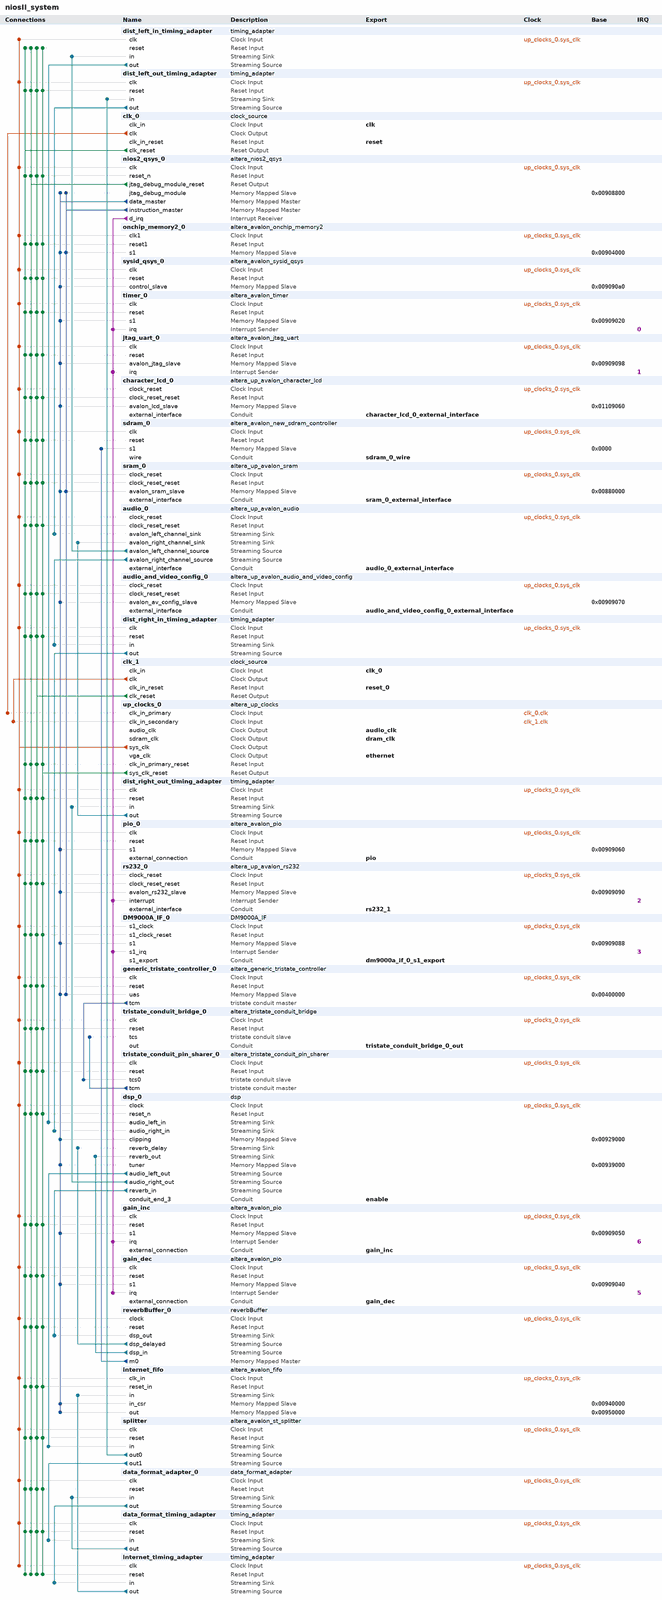
[diagram p0: system contents, whole]
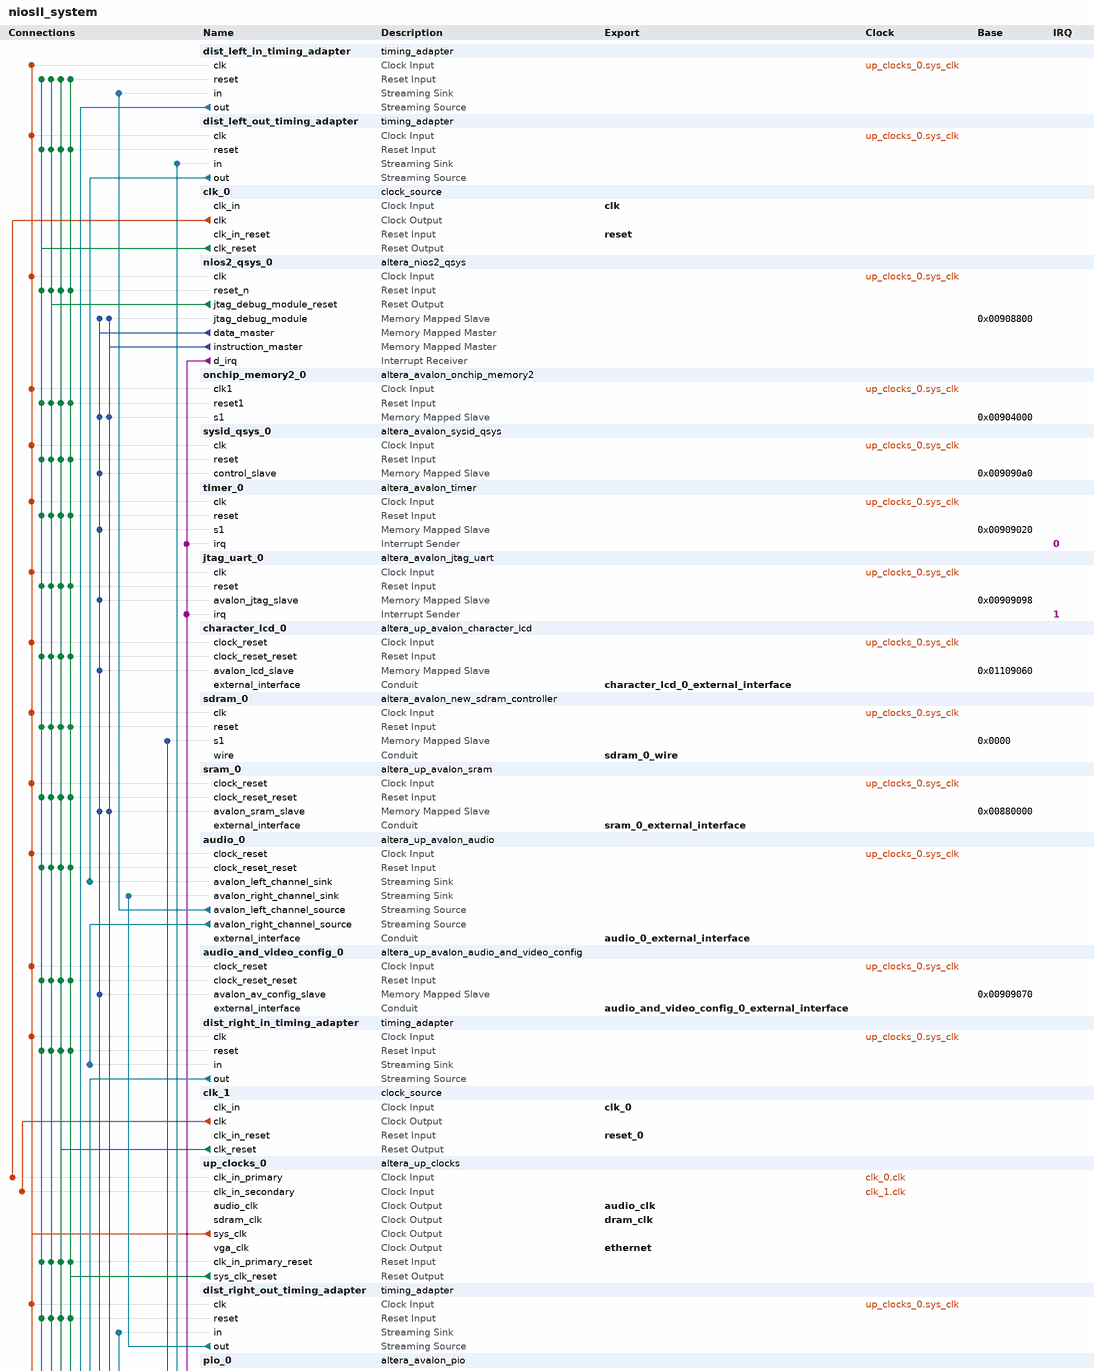
[diagram p1: system contents, upper part]
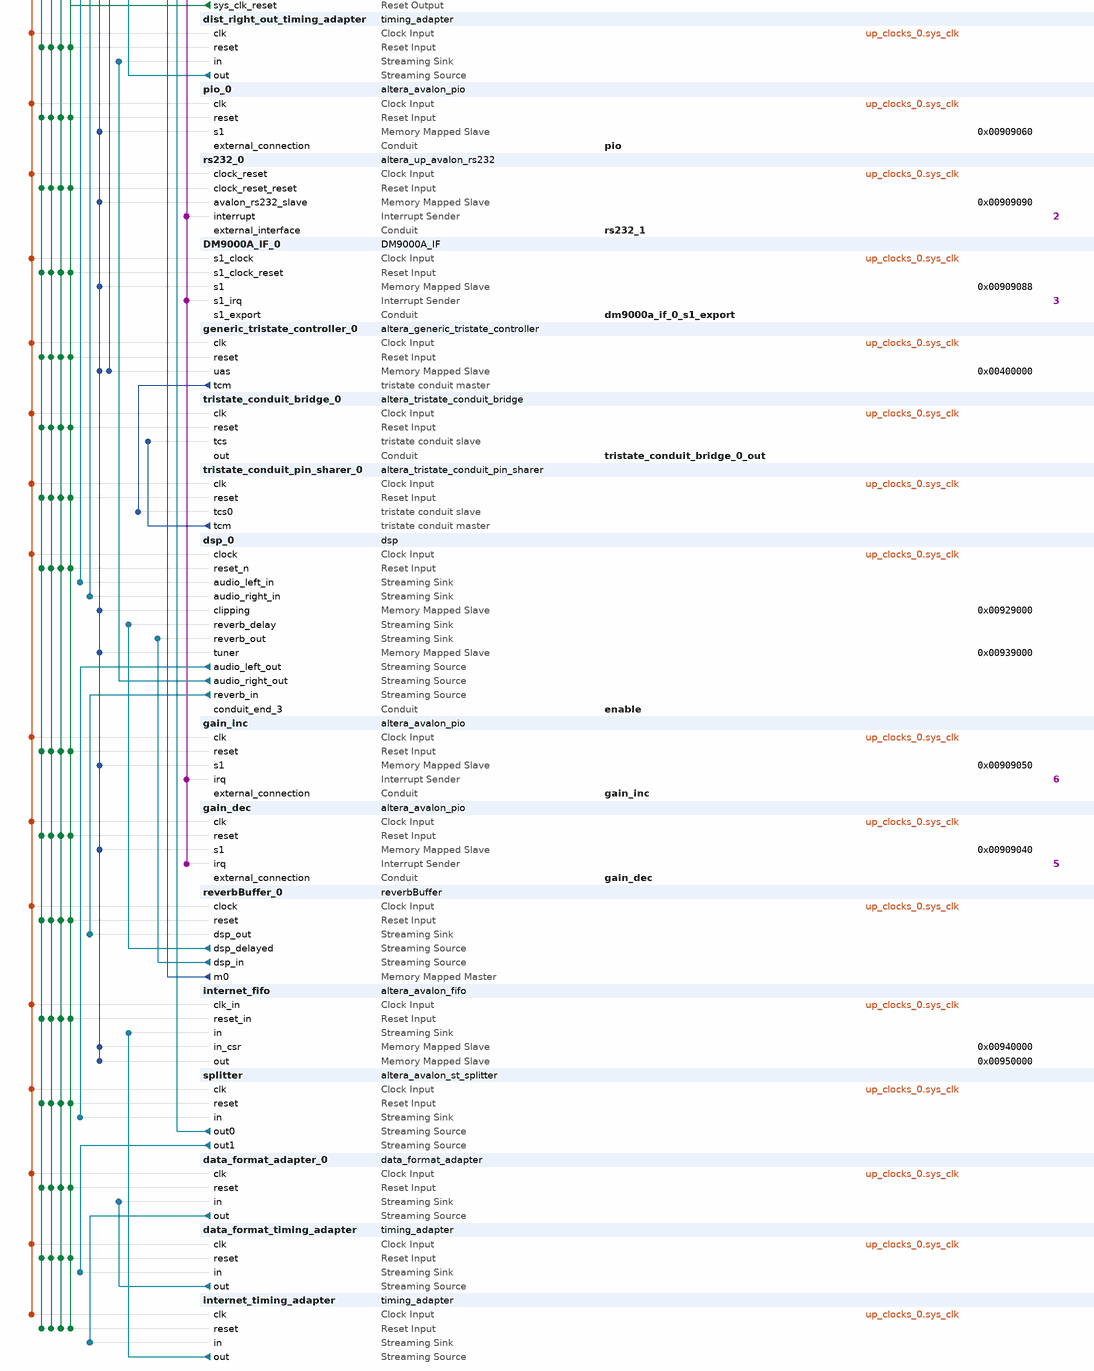
[diagram p2: system contents, lower part]
# Platform Designer (Qsys) system niosII_system, Cyclone II EP2C35F672C6
# Parameters at their usual value, and those the tool derives, are not listed.
package require -exact qsys 12.1
create_system niosII_system
set_project_property DEVICE_FAMILY {Cyclone II}
set_project_property DEVICE EP2C35F672C6

add_instance dist_left_in_timing_adapter timing_adapter 12.1
set_instance_parameter_value dist_left_in_timing_adapter inBitsPerSymbol 8
set_instance_parameter_value dist_left_in_timing_adapter inChannelWidth 0
set_instance_parameter_value dist_left_in_timing_adapter inErrorWidth 0
set_instance_parameter_value dist_left_in_timing_adapter inMaxChannel 0
set_instance_parameter_value dist_left_in_timing_adapter inReadyLatency 0
set_instance_parameter_value dist_left_in_timing_adapter inSymbolsPerBeat 2
set_instance_parameter_value dist_left_in_timing_adapter inUseEmptyPort NO
set_instance_parameter_value dist_left_in_timing_adapter inUsePackets false
set_instance_parameter_value dist_left_in_timing_adapter inUseReady true
set_instance_parameter_value dist_left_in_timing_adapter inUseValid true
set_instance_parameter_value dist_left_in_timing_adapter outReadyLatency 0
set_instance_parameter_value dist_left_in_timing_adapter outUseReady false
set_instance_parameter_value dist_left_in_timing_adapter outUseValid true

add_instance dist_left_out_timing_adapter timing_adapter 12.1
set_instance_parameter_value dist_left_out_timing_adapter inBitsPerSymbol 8
set_instance_parameter_value dist_left_out_timing_adapter inChannelWidth 0
set_instance_parameter_value dist_left_out_timing_adapter inErrorWidth 0
set_instance_parameter_value dist_left_out_timing_adapter inMaxChannel 0
set_instance_parameter_value dist_left_out_timing_adapter inReadyLatency 0
set_instance_parameter_value dist_left_out_timing_adapter inSymbolsPerBeat 2
set_instance_parameter_value dist_left_out_timing_adapter inUseEmptyPort NO
set_instance_parameter_value dist_left_out_timing_adapter inUsePackets false
set_instance_parameter_value dist_left_out_timing_adapter inUseReady false
set_instance_parameter_value dist_left_out_timing_adapter inUseValid true
set_instance_parameter_value dist_left_out_timing_adapter outReadyLatency 0
set_instance_parameter_value dist_left_out_timing_adapter outUseReady true
set_instance_parameter_value dist_left_out_timing_adapter outUseValid true

add_instance clk_0 clock_source 12.1
set_instance_parameter_value clk_0 clockFrequency 50000000

add_instance nios2_qsys_0 altera_nios2_qsys 12.1
set_instance_parameter_value nios2_qsys_0 resetSlave generic_tristate_controller_0.uas
set_instance_parameter_value nios2_qsys_0 exceptionSlave onchip_memory2_0.s1
set_instance_parameter_value nios2_qsys_0 breakSlave nios2_qsys_0.jtag_debug_module
set_instance_parameter_value nios2_qsys_0 impl Small
set_instance_parameter_value nios2_qsys_0 icache_size 4096

add_instance onchip_memory2_0 altera_avalon_onchip_memory2 12.1
set_instance_parameter_value onchip_memory2_0 dataWidth 32
set_instance_parameter_value onchip_memory2_0 dualPort false
set_instance_parameter_value onchip_memory2_0 initMemContent true
set_instance_parameter_value onchip_memory2_0 initializationFileName onchip_memory2_0
set_instance_parameter_value onchip_memory2_0 memorySize 16384

add_instance sysid_qsys_0 altera_avalon_sysid_qsys 12.1
set_instance_parameter_value sysid_qsys_0 id 0

add_instance timer_0 altera_avalon_timer 12.1
set_instance_parameter_value timer_0 period 1
set_instance_parameter_value timer_0 periodUnits MSEC
set_instance_parameter_value timer_0 timerPreset CUSTOM

add_instance jtag_uart_0 altera_avalon_jtag_uart 12.1
set_instance_parameter_value jtag_uart_0 simInteractiveOptions INTERACTIVE_INPUT_OUTPUT

add_instance character_lcd_0 altera_up_avalon_character_lcd 12.0
set_instance_parameter_value character_lcd_0 cursor Normal

add_instance sdram_0 altera_avalon_new_sdram_controller 12.1
set_instance_parameter_value sdram_0 TAC 5.5
set_instance_parameter_value sdram_0 TRCD 20.0
set_instance_parameter_value sdram_0 TRP 20.0
set_instance_parameter_value sdram_0 casLatency 3
set_instance_parameter_value sdram_0 columnWidth 8
set_instance_parameter_value sdram_0 dataWidth 16
set_instance_parameter_value sdram_0 generateSimulationModel false
set_instance_parameter_value sdram_0 model custom
set_instance_parameter_value sdram_0 numberOfBanks 4
set_instance_parameter_value sdram_0 numberOfChipSelects 1
set_instance_parameter_value sdram_0 powerUpDelay 100.0
set_instance_parameter_value sdram_0 refreshPeriod 15.625
set_instance_parameter_value sdram_0 rowWidth 12

add_instance sram_0 altera_up_avalon_sram 12.0
set_instance_parameter_value sram_0 board DE2
set_instance_parameter_value sram_0 pixel_buffer false

add_instance audio_0 altera_up_avalon_audio 12.0
set_instance_parameter_value audio_0 avalon_bus_type Streaming
set_instance_parameter_value audio_0 audio_in true
set_instance_parameter_value audio_0 dw 16

add_instance audio_and_video_config_0 altera_up_avalon_audio_and_video_config 12.0
set_instance_parameter_value audio_and_video_config_0 board DE2
set_instance_parameter_value audio_and_video_config_0 audio_in {Line In to ADC}
set_instance_parameter_value audio_and_video_config_0 line_in_bypass false
set_instance_parameter_value audio_and_video_config_0 bit_length 16
set_instance_parameter_value audio_and_video_config_0 sampling_rate {48 kHz}

add_instance dist_right_in_timing_adapter timing_adapter 12.1
set_instance_parameter_value dist_right_in_timing_adapter inBitsPerSymbol 8
set_instance_parameter_value dist_right_in_timing_adapter inChannelWidth 0
set_instance_parameter_value dist_right_in_timing_adapter inErrorWidth 0
set_instance_parameter_value dist_right_in_timing_adapter inMaxChannel 0
set_instance_parameter_value dist_right_in_timing_adapter inReadyLatency 0
set_instance_parameter_value dist_right_in_timing_adapter inSymbolsPerBeat 2
set_instance_parameter_value dist_right_in_timing_adapter inUseEmptyPort NO
set_instance_parameter_value dist_right_in_timing_adapter inUsePackets false
set_instance_parameter_value dist_right_in_timing_adapter inUseReady true
set_instance_parameter_value dist_right_in_timing_adapter inUseValid true
set_instance_parameter_value dist_right_in_timing_adapter outReadyLatency 0
set_instance_parameter_value dist_right_in_timing_adapter outUseReady false
set_instance_parameter_value dist_right_in_timing_adapter outUseValid true

add_instance clk_1 clock_source 12.1
set_instance_parameter_value clk_1 clockFrequency 27000000

add_instance up_clocks_0 altera_up_clocks 12.0
set_instance_parameter_value up_clocks_0 board DE2
set_instance_parameter_value up_clocks_0 vga_clk true
set_instance_parameter_value up_clocks_0 audio_clk true
set_instance_parameter_value up_clocks_0 audio_clk_freq 11.2896

add_instance dist_right_out_timing_adapter timing_adapter 12.1
set_instance_parameter_value dist_right_out_timing_adapter inBitsPerSymbol 8
set_instance_parameter_value dist_right_out_timing_adapter inChannelWidth 0
set_instance_parameter_value dist_right_out_timing_adapter inErrorWidth 0
set_instance_parameter_value dist_right_out_timing_adapter inMaxChannel 0
set_instance_parameter_value dist_right_out_timing_adapter inReadyLatency 0
set_instance_parameter_value dist_right_out_timing_adapter inSymbolsPerBeat 2
set_instance_parameter_value dist_right_out_timing_adapter inUseEmptyPort NO
set_instance_parameter_value dist_right_out_timing_adapter inUsePackets false
set_instance_parameter_value dist_right_out_timing_adapter inUseReady false
set_instance_parameter_value dist_right_out_timing_adapter inUseValid true
set_instance_parameter_value dist_right_out_timing_adapter outReadyLatency 0
set_instance_parameter_value dist_right_out_timing_adapter outUseReady true
set_instance_parameter_value dist_right_out_timing_adapter outUseValid true

add_instance pio_0 altera_avalon_pio 12.1
set_instance_parameter_value pio_0 direction Input
set_instance_parameter_value pio_0 width 5

add_instance rs232_0 altera_up_avalon_rs232 12.0
set_instance_parameter_value rs232_0 baud 9600
set_instance_parameter_value rs232_0 parity None

add_instance DM9000A_IF_0 DM9000A_IF 1.0

add_instance generic_tristate_controller_0 altera_generic_tristate_controller 12.1
set_instance_parameter_value generic_tristate_controller_0 TCM_ADDRESS_W 22
set_instance_parameter_value generic_tristate_controller_0 TCM_DATA_W 8
set_instance_parameter_value generic_tristate_controller_0 TCM_BYTEENABLE_W 1
set_instance_parameter_value generic_tristate_controller_0 TCM_READ_WAIT 160
set_instance_parameter_value generic_tristate_controller_0 TCM_WRITE_WAIT 160
set_instance_parameter_value generic_tristate_controller_0 TCM_SETUP_WAIT 40
set_instance_parameter_value generic_tristate_controller_0 TCM_DATA_HOLD 40
set_instance_parameter_value generic_tristate_controller_0 TCM_MAX_PENDING_READ_TRANSACTIONS 3
set_instance_parameter_value generic_tristate_controller_0 TCM_TURNAROUND_TIME 2
set_instance_parameter_value generic_tristate_controller_0 TCM_TIMING_UNITS 0
set_instance_parameter_value generic_tristate_controller_0 TCM_READLATENCY 2
set_instance_parameter_value generic_tristate_controller_0 TCM_SYMBOLS_PER_WORD 1
set_instance_parameter_value generic_tristate_controller_0 USE_READ 1
set_instance_parameter_value generic_tristate_controller_0 USE_BEGINTRANSFER 0
set_instance_parameter_value generic_tristate_controller_0 USE_BYTEENABLE 0
set_instance_parameter_value generic_tristate_controller_0 USE_OUTPUTENABLE 0
set_instance_parameter_value generic_tristate_controller_0 ACTIVE_LOW_READ 1
set_instance_parameter_value generic_tristate_controller_0 ACTIVE_LOW_BYTEENABLE 0
set_instance_parameter_value generic_tristate_controller_0 ACTIVE_LOW_OUTPUTENABLE 0
set_instance_parameter_value generic_tristate_controller_0 ACTIVE_LOW_BEGINTRANSFER 0
set_instance_parameter_value generic_tristate_controller_0 CHIPSELECT_THROUGH_READLATENCY 0
set_instance_parameter_value generic_tristate_controller_0 MODULE_ASSIGNMENT_KEYS embeddedsw.configuration.hwClassnameDriverSupportList,embeddedsw.configuration.isFlash,embeddedsw.configuration.isMemoryDevice,embeddedsw.configuration.isNonVolatileStorage
set_instance_parameter_value generic_tristate_controller_0 MODULE_ASSIGNMENT_VALUES "altera_avalon_lan91c111\\,altera_avalon_cfi_flash,1,1,1"
set_instance_parameter_value generic_tristate_controller_0 INTERFACE_ASSIGNMENT_KEYS embeddedsw.configuration.isFlash,embeddedsw.configuration.isMemoryDevice,embeddedsw.configuration.isNonVolatileStorage
set_instance_parameter_value generic_tristate_controller_0 INTERFACE_ASSIGNMENT_VALUES 1,1,1

add_instance tristate_conduit_bridge_0 altera_tristate_conduit_bridge 12.1

add_instance tristate_conduit_pin_sharer_0 altera_tristate_conduit_pin_sharer 12.1
set_instance_parameter_value tristate_conduit_pin_sharer_0 NUM_INTERFACES 1
set_instance_parameter_value tristate_conduit_pin_sharer_0 MODULE_ORIGIN_LIST generic_tristate_controller_0.tcm,generic_tristate_controller_0.tcm,generic_tristate_controller_0.tcm,generic_tristate_controller_0.tcm,generic_tristate_controller_0.tcm

add_instance dsp_0 dsp 1.0

add_instance gain_inc altera_avalon_pio 12.1
set_instance_parameter_value gain_inc captureEdge true
set_instance_parameter_value gain_inc direction Input
set_instance_parameter_value gain_inc edgeType FALLING
set_instance_parameter_value gain_inc generateIRQ true
set_instance_parameter_value gain_inc irqType EDGE
set_instance_parameter_value gain_inc width 1

add_instance gain_dec altera_avalon_pio 12.1
set_instance_parameter_value gain_dec captureEdge true
set_instance_parameter_value gain_dec direction Input
set_instance_parameter_value gain_dec edgeType FALLING
set_instance_parameter_value gain_dec generateIRQ true
set_instance_parameter_value gain_dec irqType EDGE
set_instance_parameter_value gain_dec width 1

add_instance reverbBuffer_0 reverbBuffer 1.0
set_instance_parameter_value reverbBuffer_0 base_addr 0
set_instance_parameter_value reverbBuffer_0 buffersize 1321

add_instance internet_fifo altera_avalon_fifo 12.1
set_instance_parameter_value internet_fifo bitsPerSymbol 8
set_instance_parameter_value internet_fifo channelWidth 0
set_instance_parameter_value internet_fifo errorWidth 0
set_instance_parameter_value internet_fifo fifoDepth 4096
set_instance_parameter_value internet_fifo fifoInputInterfaceOptions AVALONST_SINK
set_instance_parameter_value internet_fifo fifoOutputInterfaceOptions AVALONMM_READ
set_instance_parameter_value internet_fifo singleClockMode true
set_instance_parameter_value internet_fifo symbolsPerBeat 4
set_instance_parameter_value internet_fifo useIRQ false
set_instance_parameter_value internet_fifo usePacket false
set_instance_parameter_value internet_fifo useReadControl false

add_instance splitter altera_avalon_st_splitter 12.1
set_instance_parameter_value splitter NUMBER_OF_OUTPUTS 2
set_instance_parameter_value splitter QUALIFY_VALID_OUT 1
set_instance_parameter_value splitter USE_READY 0
set_instance_parameter_value splitter USE_VALID 1
set_instance_parameter_value splitter USE_PACKETS 0
set_instance_parameter_value splitter USE_CHANNEL 0
set_instance_parameter_value splitter USE_ERROR 0
set_instance_parameter_value splitter USE_DATA 1
set_instance_parameter_value splitter DATA_WIDTH 16
set_instance_parameter_value splitter CHANNEL_WIDTH 1
set_instance_parameter_value splitter ERROR_WIDTH 1
set_instance_parameter_value splitter BITS_PER_SYMBOL 8
set_instance_parameter_value splitter MAX_CHANNELS 1
set_instance_parameter_value splitter READY_LATENCY 0

add_instance data_format_adapter_0 data_format_adapter 12.1
set_instance_parameter_value data_format_adapter_0 generationLanguage VERILOG
set_instance_parameter_value data_format_adapter_0 inBitsPerSymbol 8
set_instance_parameter_value data_format_adapter_0 inChannelWidth 0
set_instance_parameter_value data_format_adapter_0 inErrorWidth 0
set_instance_parameter_value data_format_adapter_0 inMaxChannel 0
set_instance_parameter_value data_format_adapter_0 inReadyLatency 0
set_instance_parameter_value data_format_adapter_0 inSymbolsPerBeat 2
set_instance_parameter_value data_format_adapter_0 inUseEmpty false
set_instance_parameter_value data_format_adapter_0 inUseEmptyPort AUTO
set_instance_parameter_value data_format_adapter_0 inUsePackets false
set_instance_parameter_value data_format_adapter_0 inUseReady true
set_instance_parameter_value data_format_adapter_0 outSymbolsPerBeat 4
set_instance_parameter_value data_format_adapter_0 outUseEmpty false
set_instance_parameter_value data_format_adapter_0 outUseEmptyPort AUTO

add_instance data_format_timing_adapter timing_adapter 12.1
set_instance_parameter_value data_format_timing_adapter inBitsPerSymbol 8
set_instance_parameter_value data_format_timing_adapter inChannelWidth 0
set_instance_parameter_value data_format_timing_adapter inErrorWidth 0
set_instance_parameter_value data_format_timing_adapter inMaxChannel 0
set_instance_parameter_value data_format_timing_adapter inReadyLatency 0
set_instance_parameter_value data_format_timing_adapter inSymbolsPerBeat 2
set_instance_parameter_value data_format_timing_adapter inUseEmptyPort NO
set_instance_parameter_value data_format_timing_adapter inUsePackets false
set_instance_parameter_value data_format_timing_adapter inUseReady false
set_instance_parameter_value data_format_timing_adapter inUseValid true
set_instance_parameter_value data_format_timing_adapter outReadyLatency 0
set_instance_parameter_value data_format_timing_adapter outUseReady true
set_instance_parameter_value data_format_timing_adapter outUseValid true

add_instance internet_timing_adapter timing_adapter 12.1
set_instance_parameter_value internet_timing_adapter inBitsPerSymbol 8
set_instance_parameter_value internet_timing_adapter inChannelWidth 0
set_instance_parameter_value internet_timing_adapter inErrorWidth 0
set_instance_parameter_value internet_timing_adapter inMaxChannel 0
set_instance_parameter_value internet_timing_adapter inReadyLatency 0
set_instance_parameter_value internet_timing_adapter inSymbolsPerBeat 4
set_instance_parameter_value internet_timing_adapter inUseEmptyPort NO
set_instance_parameter_value internet_timing_adapter inUsePackets false
set_instance_parameter_value internet_timing_adapter inUseReady true
set_instance_parameter_value internet_timing_adapter inUseValid true
set_instance_parameter_value internet_timing_adapter outReadyLatency 1
set_instance_parameter_value internet_timing_adapter outUseReady true
set_instance_parameter_value internet_timing_adapter outUseValid true

# connections
add_connection clk_0.clk up_clocks_0.clk_in_primary clock
add_connection clk_1.clk up_clocks_0.clk_in_secondary clock
add_connection up_clocks_0.sys_clk audio_0.clock_reset clock
add_connection up_clocks_0.sys_clk audio_and_video_config_0.clock_reset clock
add_connection up_clocks_0.sys_clk character_lcd_0.clock_reset clock
add_connection up_clocks_0.sys_clk data_format_adapter_0.clk clock
add_connection up_clocks_0.sys_clk data_format_timing_adapter.clk clock
add_connection up_clocks_0.sys_clk dist_left_in_timing_adapter.clk clock
add_connection up_clocks_0.sys_clk dist_left_out_timing_adapter.clk clock
add_connection up_clocks_0.sys_clk dist_right_in_timing_adapter.clk clock
add_connection up_clocks_0.sys_clk dist_right_out_timing_adapter.clk clock
add_connection up_clocks_0.sys_clk DM9000A_IF_0.s1_clock clock
add_connection up_clocks_0.sys_clk dsp_0.clock clock
add_connection up_clocks_0.sys_clk gain_dec.clk clock
add_connection up_clocks_0.sys_clk gain_inc.clk clock
add_connection up_clocks_0.sys_clk generic_tristate_controller_0.clk clock
add_connection up_clocks_0.sys_clk internet_fifo.clk_in clock
add_connection up_clocks_0.sys_clk internet_timing_adapter.clk clock
add_connection up_clocks_0.sys_clk jtag_uart_0.clk clock
add_connection up_clocks_0.sys_clk nios2_qsys_0.clk clock
add_connection up_clocks_0.sys_clk onchip_memory2_0.clk1 clock
add_connection up_clocks_0.sys_clk pio_0.clk clock
add_connection up_clocks_0.sys_clk reverbBuffer_0.clock clock
add_connection up_clocks_0.sys_clk rs232_0.clock_reset clock
add_connection up_clocks_0.sys_clk sdram_0.clk clock
add_connection up_clocks_0.sys_clk splitter.clk clock
add_connection up_clocks_0.sys_clk sram_0.clock_reset clock
add_connection up_clocks_0.sys_clk sysid_qsys_0.clk clock
add_connection up_clocks_0.sys_clk timer_0.clk clock
add_connection up_clocks_0.sys_clk tristate_conduit_bridge_0.clk clock
add_connection up_clocks_0.sys_clk tristate_conduit_pin_sharer_0.clk clock
add_connection clk_0.clk_reset audio_0.clock_reset_reset reset
add_connection clk_0.clk_reset audio_and_video_config_0.clock_reset_reset reset
add_connection clk_0.clk_reset character_lcd_0.clock_reset_reset reset
add_connection clk_0.clk_reset data_format_adapter_0.reset reset
add_connection clk_0.clk_reset data_format_timing_adapter.reset reset
add_connection clk_0.clk_reset dist_left_in_timing_adapter.reset reset
add_connection clk_0.clk_reset dist_left_out_timing_adapter.reset reset
add_connection clk_0.clk_reset dist_right_in_timing_adapter.reset reset
add_connection clk_0.clk_reset dist_right_out_timing_adapter.reset reset
add_connection clk_0.clk_reset DM9000A_IF_0.s1_clock_reset reset
add_connection clk_0.clk_reset dsp_0.reset_n reset
add_connection clk_0.clk_reset gain_dec.reset reset
add_connection clk_0.clk_reset gain_inc.reset reset
add_connection clk_0.clk_reset generic_tristate_controller_0.reset reset
add_connection clk_0.clk_reset internet_fifo.reset_in reset
add_connection clk_0.clk_reset internet_timing_adapter.reset reset
add_connection clk_0.clk_reset jtag_uart_0.reset reset
add_connection clk_0.clk_reset nios2_qsys_0.reset_n reset
add_connection clk_0.clk_reset onchip_memory2_0.reset1 reset
add_connection clk_0.clk_reset pio_0.reset reset
add_connection clk_0.clk_reset reverbBuffer_0.reset reset
add_connection clk_0.clk_reset rs232_0.clock_reset_reset reset
add_connection clk_0.clk_reset sdram_0.reset reset
add_connection clk_0.clk_reset splitter.reset reset
add_connection clk_0.clk_reset sram_0.clock_reset_reset reset
add_connection clk_0.clk_reset sysid_qsys_0.reset reset
add_connection clk_0.clk_reset timer_0.reset reset
add_connection clk_0.clk_reset tristate_conduit_bridge_0.reset reset
add_connection clk_0.clk_reset tristate_conduit_pin_sharer_0.reset reset
add_connection clk_0.clk_reset up_clocks_0.clk_in_primary_reset reset
add_connection clk_1.clk_reset audio_0.clock_reset_reset reset
add_connection clk_1.clk_reset audio_and_video_config_0.clock_reset_reset reset
add_connection clk_1.clk_reset character_lcd_0.clock_reset_reset reset
add_connection clk_1.clk_reset data_format_adapter_0.reset reset
add_connection clk_1.clk_reset data_format_timing_adapter.reset reset
add_connection clk_1.clk_reset dist_left_in_timing_adapter.reset reset
add_connection clk_1.clk_reset dist_left_out_timing_adapter.reset reset
add_connection clk_1.clk_reset dist_right_in_timing_adapter.reset reset
add_connection clk_1.clk_reset dist_right_out_timing_adapter.reset reset
add_connection clk_1.clk_reset DM9000A_IF_0.s1_clock_reset reset
add_connection clk_1.clk_reset dsp_0.reset_n reset
add_connection clk_1.clk_reset gain_dec.reset reset
add_connection clk_1.clk_reset gain_inc.reset reset
add_connection clk_1.clk_reset generic_tristate_controller_0.reset reset
add_connection clk_1.clk_reset internet_fifo.reset_in reset
add_connection clk_1.clk_reset internet_timing_adapter.reset reset
add_connection clk_1.clk_reset jtag_uart_0.reset reset
add_connection clk_1.clk_reset nios2_qsys_0.reset_n reset
add_connection clk_1.clk_reset onchip_memory2_0.reset1 reset
add_connection clk_1.clk_reset pio_0.reset reset
add_connection clk_1.clk_reset reverbBuffer_0.reset reset
add_connection clk_1.clk_reset rs232_0.clock_reset_reset reset
add_connection clk_1.clk_reset sdram_0.reset reset
add_connection clk_1.clk_reset splitter.reset reset
add_connection clk_1.clk_reset sram_0.clock_reset_reset reset
add_connection clk_1.clk_reset sysid_qsys_0.reset reset
add_connection clk_1.clk_reset timer_0.reset reset
add_connection clk_1.clk_reset tristate_conduit_bridge_0.reset reset
add_connection clk_1.clk_reset tristate_conduit_pin_sharer_0.reset reset
add_connection clk_1.clk_reset up_clocks_0.clk_in_primary_reset reset
add_connection nios2_qsys_0.jtag_debug_module_reset audio_0.clock_reset_reset reset
add_connection nios2_qsys_0.jtag_debug_module_reset audio_and_video_config_0.clock_reset_reset reset
add_connection nios2_qsys_0.jtag_debug_module_reset character_lcd_0.clock_reset_reset reset
add_connection nios2_qsys_0.jtag_debug_module_reset data_format_adapter_0.reset reset
add_connection nios2_qsys_0.jtag_debug_module_reset data_format_timing_adapter.reset reset
add_connection nios2_qsys_0.jtag_debug_module_reset dist_left_in_timing_adapter.reset reset
add_connection nios2_qsys_0.jtag_debug_module_reset dist_left_out_timing_adapter.reset reset
add_connection nios2_qsys_0.jtag_debug_module_reset dist_right_in_timing_adapter.reset reset
add_connection nios2_qsys_0.jtag_debug_module_reset dist_right_out_timing_adapter.reset reset
add_connection nios2_qsys_0.jtag_debug_module_reset DM9000A_IF_0.s1_clock_reset reset
add_connection nios2_qsys_0.jtag_debug_module_reset dsp_0.reset_n reset
add_connection nios2_qsys_0.jtag_debug_module_reset gain_dec.reset reset
add_connection nios2_qsys_0.jtag_debug_module_reset gain_inc.reset reset
add_connection nios2_qsys_0.jtag_debug_module_reset generic_tristate_controller_0.reset reset
add_connection nios2_qsys_0.jtag_debug_module_reset internet_fifo.reset_in reset
add_connection nios2_qsys_0.jtag_debug_module_reset internet_timing_adapter.reset reset
add_connection nios2_qsys_0.jtag_debug_module_reset jtag_uart_0.reset reset
add_connection nios2_qsys_0.jtag_debug_module_reset nios2_qsys_0.reset_n reset
add_connection nios2_qsys_0.jtag_debug_module_reset onchip_memory2_0.reset1 reset
add_connection nios2_qsys_0.jtag_debug_module_reset pio_0.reset reset
add_connection nios2_qsys_0.jtag_debug_module_reset reverbBuffer_0.reset reset
add_connection nios2_qsys_0.jtag_debug_module_reset rs232_0.clock_reset_reset reset
add_connection nios2_qsys_0.jtag_debug_module_reset sdram_0.reset reset
add_connection nios2_qsys_0.jtag_debug_module_reset splitter.reset reset
add_connection nios2_qsys_0.jtag_debug_module_reset sram_0.clock_reset_reset reset
add_connection nios2_qsys_0.jtag_debug_module_reset sysid_qsys_0.reset reset
add_connection nios2_qsys_0.jtag_debug_module_reset timer_0.reset reset
add_connection nios2_qsys_0.jtag_debug_module_reset tristate_conduit_bridge_0.reset reset
add_connection nios2_qsys_0.jtag_debug_module_reset tristate_conduit_pin_sharer_0.reset reset
add_connection nios2_qsys_0.jtag_debug_module_reset up_clocks_0.clk_in_primary_reset reset
add_connection up_clocks_0.sys_clk_reset audio_0.clock_reset_reset reset
add_connection up_clocks_0.sys_clk_reset audio_and_video_config_0.clock_reset_reset reset
add_connection up_clocks_0.sys_clk_reset character_lcd_0.clock_reset_reset reset
add_connection up_clocks_0.sys_clk_reset data_format_adapter_0.reset reset
add_connection up_clocks_0.sys_clk_reset data_format_timing_adapter.reset reset
add_connection up_clocks_0.sys_clk_reset dist_left_in_timing_adapter.reset reset
add_connection up_clocks_0.sys_clk_reset dist_left_out_timing_adapter.reset reset
add_connection up_clocks_0.sys_clk_reset dist_right_in_timing_adapter.reset reset
add_connection up_clocks_0.sys_clk_reset dist_right_out_timing_adapter.reset reset
add_connection up_clocks_0.sys_clk_reset DM9000A_IF_0.s1_clock_reset reset
add_connection up_clocks_0.sys_clk_reset dsp_0.reset_n reset
add_connection up_clocks_0.sys_clk_reset gain_dec.reset reset
add_connection up_clocks_0.sys_clk_reset gain_inc.reset reset
add_connection up_clocks_0.sys_clk_reset generic_tristate_controller_0.reset reset
add_connection up_clocks_0.sys_clk_reset internet_fifo.reset_in reset
add_connection up_clocks_0.sys_clk_reset internet_timing_adapter.reset reset
add_connection up_clocks_0.sys_clk_reset jtag_uart_0.reset reset
add_connection up_clocks_0.sys_clk_reset nios2_qsys_0.reset_n reset
add_connection up_clocks_0.sys_clk_reset onchip_memory2_0.reset1 reset
add_connection up_clocks_0.sys_clk_reset pio_0.reset reset
add_connection up_clocks_0.sys_clk_reset reverbBuffer_0.reset reset
add_connection up_clocks_0.sys_clk_reset rs232_0.clock_reset_reset reset
add_connection up_clocks_0.sys_clk_reset sdram_0.reset reset
add_connection up_clocks_0.sys_clk_reset splitter.reset reset
add_connection up_clocks_0.sys_clk_reset sram_0.clock_reset_reset reset
add_connection up_clocks_0.sys_clk_reset sysid_qsys_0.reset reset
add_connection up_clocks_0.sys_clk_reset timer_0.reset reset
add_connection up_clocks_0.sys_clk_reset tristate_conduit_bridge_0.reset reset
add_connection up_clocks_0.sys_clk_reset tristate_conduit_pin_sharer_0.reset reset
add_connection up_clocks_0.sys_clk_reset up_clocks_0.clk_in_primary_reset reset
add_connection nios2_qsys_0.data_master audio_and_video_config_0.avalon_av_config_slave avalon
set_connection_parameter_value nios2_qsys_0.data_master/audio_and_video_config_0.avalon_av_config_slave baseAddress 0x00909070
add_connection nios2_qsys_0.data_master character_lcd_0.avalon_lcd_slave avalon
set_connection_parameter_value nios2_qsys_0.data_master/character_lcd_0.avalon_lcd_slave baseAddress 0x01109060
add_connection nios2_qsys_0.data_master DM9000A_IF_0.s1 avalon
set_connection_parameter_value nios2_qsys_0.data_master/DM9000A_IF_0.s1 baseAddress 0x00909088
add_connection nios2_qsys_0.data_master dsp_0.clipping avalon
set_connection_parameter_value nios2_qsys_0.data_master/dsp_0.clipping baseAddress 0x00929000
add_connection nios2_qsys_0.data_master dsp_0.tuner avalon
set_connection_parameter_value nios2_qsys_0.data_master/dsp_0.tuner baseAddress 0x00939000
add_connection nios2_qsys_0.data_master gain_dec.s1 avalon
set_connection_parameter_value nios2_qsys_0.data_master/gain_dec.s1 baseAddress 0x00909040
add_connection nios2_qsys_0.data_master gain_inc.s1 avalon
set_connection_parameter_value nios2_qsys_0.data_master/gain_inc.s1 baseAddress 0x00909050
add_connection nios2_qsys_0.data_master generic_tristate_controller_0.uas avalon
set_connection_parameter_value nios2_qsys_0.data_master/generic_tristate_controller_0.uas baseAddress 0x00400000
add_connection nios2_qsys_0.data_master internet_fifo.in_csr avalon
set_connection_parameter_value nios2_qsys_0.data_master/internet_fifo.in_csr baseAddress 0x00940000
add_connection nios2_qsys_0.data_master internet_fifo.out avalon
set_connection_parameter_value nios2_qsys_0.data_master/internet_fifo.out baseAddress 0x00950000
add_connection nios2_qsys_0.data_master jtag_uart_0.avalon_jtag_slave avalon
set_connection_parameter_value nios2_qsys_0.data_master/jtag_uart_0.avalon_jtag_slave baseAddress 0x00909098
add_connection nios2_qsys_0.data_master nios2_qsys_0.jtag_debug_module avalon
set_connection_parameter_value nios2_qsys_0.data_master/nios2_qsys_0.jtag_debug_module baseAddress 0x00908800
add_connection nios2_qsys_0.data_master onchip_memory2_0.s1 avalon
set_connection_parameter_value nios2_qsys_0.data_master/onchip_memory2_0.s1 baseAddress 0x00904000
add_connection nios2_qsys_0.data_master pio_0.s1 avalon
set_connection_parameter_value nios2_qsys_0.data_master/pio_0.s1 baseAddress 0x00909060
add_connection nios2_qsys_0.data_master rs232_0.avalon_rs232_slave avalon
set_connection_parameter_value nios2_qsys_0.data_master/rs232_0.avalon_rs232_slave baseAddress 0x00909090
add_connection nios2_qsys_0.data_master sram_0.avalon_sram_slave avalon
set_connection_parameter_value nios2_qsys_0.data_master/sram_0.avalon_sram_slave baseAddress 0x00880000
add_connection nios2_qsys_0.data_master sysid_qsys_0.control_slave avalon
set_connection_parameter_value nios2_qsys_0.data_master/sysid_qsys_0.control_slave baseAddress 0x009090a0
add_connection nios2_qsys_0.data_master timer_0.s1 avalon
set_connection_parameter_value nios2_qsys_0.data_master/timer_0.s1 baseAddress 0x00909020
add_connection nios2_qsys_0.instruction_master generic_tristate_controller_0.uas avalon
set_connection_parameter_value nios2_qsys_0.instruction_master/generic_tristate_controller_0.uas baseAddress 0x00400000
add_connection nios2_qsys_0.instruction_master nios2_qsys_0.jtag_debug_module avalon
set_connection_parameter_value nios2_qsys_0.instruction_master/nios2_qsys_0.jtag_debug_module baseAddress 0x00908800
add_connection nios2_qsys_0.instruction_master onchip_memory2_0.s1 avalon
set_connection_parameter_value nios2_qsys_0.instruction_master/onchip_memory2_0.s1 baseAddress 0x00904000
add_connection nios2_qsys_0.instruction_master sram_0.avalon_sram_slave avalon
set_connection_parameter_value nios2_qsys_0.instruction_master/sram_0.avalon_sram_slave baseAddress 0x00880000
add_connection reverbBuffer_0.m0 sdram_0.s1 avalon
set_connection_parameter_value reverbBuffer_0.m0/sdram_0.s1 baseAddress 0x0000
add_connection audio_0.avalon_left_channel_source dist_left_in_timing_adapter.in avalon_streaming
add_connection audio_0.avalon_right_channel_source dist_right_in_timing_adapter.in avalon_streaming
add_connection data_format_adapter_0.out internet_timing_adapter.in avalon_streaming
add_connection data_format_timing_adapter.out data_format_adapter_0.in avalon_streaming
add_connection dist_left_in_timing_adapter.out dsp_0.audio_left_in avalon_streaming
add_connection dist_left_out_timing_adapter.out audio_0.avalon_left_channel_sink avalon_streaming
add_connection dist_right_in_timing_adapter.out dsp_0.audio_right_in avalon_streaming
add_connection dist_right_out_timing_adapter.out audio_0.avalon_right_channel_sink avalon_streaming
add_connection dsp_0.audio_left_out splitter.in avalon_streaming
add_connection dsp_0.audio_right_out dist_right_out_timing_adapter.in avalon_streaming
add_connection dsp_0.reverb_in reverbBuffer_0.dsp_out avalon_streaming
add_connection internet_timing_adapter.out internet_fifo.in avalon_streaming
add_connection reverbBuffer_0.dsp_delayed dsp_0.reverb_delay avalon_streaming
add_connection reverbBuffer_0.dsp_in dsp_0.reverb_out avalon_streaming
add_connection splitter.out0 dist_left_out_timing_adapter.in avalon_streaming
add_connection splitter.out1 data_format_timing_adapter.in avalon_streaming
add_connection nios2_qsys_0.d_irq DM9000A_IF_0.s1_irq interrupt
set_connection_parameter_value nios2_qsys_0.d_irq/DM9000A_IF_0.s1_irq irqNumber 3
add_connection nios2_qsys_0.d_irq gain_dec.irq interrupt
set_connection_parameter_value nios2_qsys_0.d_irq/gain_dec.irq irqNumber 5
add_connection nios2_qsys_0.d_irq gain_inc.irq interrupt
set_connection_parameter_value nios2_qsys_0.d_irq/gain_inc.irq irqNumber 6
add_connection nios2_qsys_0.d_irq jtag_uart_0.irq interrupt
set_connection_parameter_value nios2_qsys_0.d_irq/jtag_uart_0.irq irqNumber 1
add_connection nios2_qsys_0.d_irq rs232_0.interrupt interrupt
set_connection_parameter_value nios2_qsys_0.d_irq/rs232_0.interrupt irqNumber 2
add_connection nios2_qsys_0.d_irq timer_0.irq interrupt
set_connection_parameter_value nios2_qsys_0.d_irq/timer_0.irq irqNumber 0
add_connection generic_tristate_controller_0.tcm tristate_conduit_pin_sharer_0.tcs0 tristate_conduit
add_connection tristate_conduit_pin_sharer_0.tcm tristate_conduit_bridge_0.tcs tristate_conduit

# exported interfaces
add_interface clk clock sink
set_interface_property clk EXPORT_OF clk_0.clk_in
add_interface reset reset sink
set_interface_property reset EXPORT_OF clk_0.clk_in_reset
add_interface character_lcd_0_external_interface conduit end
set_interface_property character_lcd_0_external_interface EXPORT_OF character_lcd_0.external_interface
add_interface sdram_0_wire conduit end
set_interface_property sdram_0_wire EXPORT_OF sdram_0.wire
add_interface sram_0_external_interface conduit end
set_interface_property sram_0_external_interface EXPORT_OF sram_0.external_interface
add_interface clk_0 clock sink
set_interface_property clk_0 EXPORT_OF clk_1.clk_in
add_interface reset_0 reset sink
set_interface_property reset_0 EXPORT_OF clk_1.clk_in_reset
add_interface audio_0_external_interface conduit end
set_interface_property audio_0_external_interface EXPORT_OF audio_0.external_interface
add_interface audio_and_video_config_0_external_interface conduit end
set_interface_property audio_and_video_config_0_external_interface EXPORT_OF audio_and_video_config_0.external_interface
add_interface dram_clk clock source
set_interface_property dram_clk EXPORT_OF up_clocks_0.sdram_clk
add_interface pio conduit end
set_interface_property pio EXPORT_OF pio_0.external_connection
add_interface rs232_1 conduit end
set_interface_property rs232_1 EXPORT_OF rs232_0.external_interface
add_interface dm9000a_if_0_s1_export conduit end
set_interface_property dm9000a_if_0_s1_export EXPORT_OF DM9000A_IF_0.s1_export
add_interface ethernet clock source
set_interface_property ethernet EXPORT_OF up_clocks_0.vga_clk
add_interface tristate_conduit_bridge_0_out conduit end
set_interface_property tristate_conduit_bridge_0_out EXPORT_OF tristate_conduit_bridge_0.out
add_interface enable conduit end
set_interface_property enable EXPORT_OF dsp_0.conduit_end_3
add_interface gain_inc conduit end
set_interface_property gain_inc EXPORT_OF gain_inc.external_connection
add_interface gain_dec conduit end
set_interface_property gain_dec EXPORT_OF gain_dec.external_connection
add_interface audio_clk clock source
set_interface_property audio_clk EXPORT_OF up_clocks_0.audio_clk

save_system niosII_system.qsys
